# Altium schematic sheet PhaseCLeg.SchDoc: Phase C
size A4; DrawnBy: Jarod Krane; Organization: Altium Limited; Address1: L3, 12a Rodborough Rd; Address2: Frenchs Forest; Address3: NSW; Address4: Australia 2086; Revision: 0; SheetNumber: 6; SheetTotal: 11
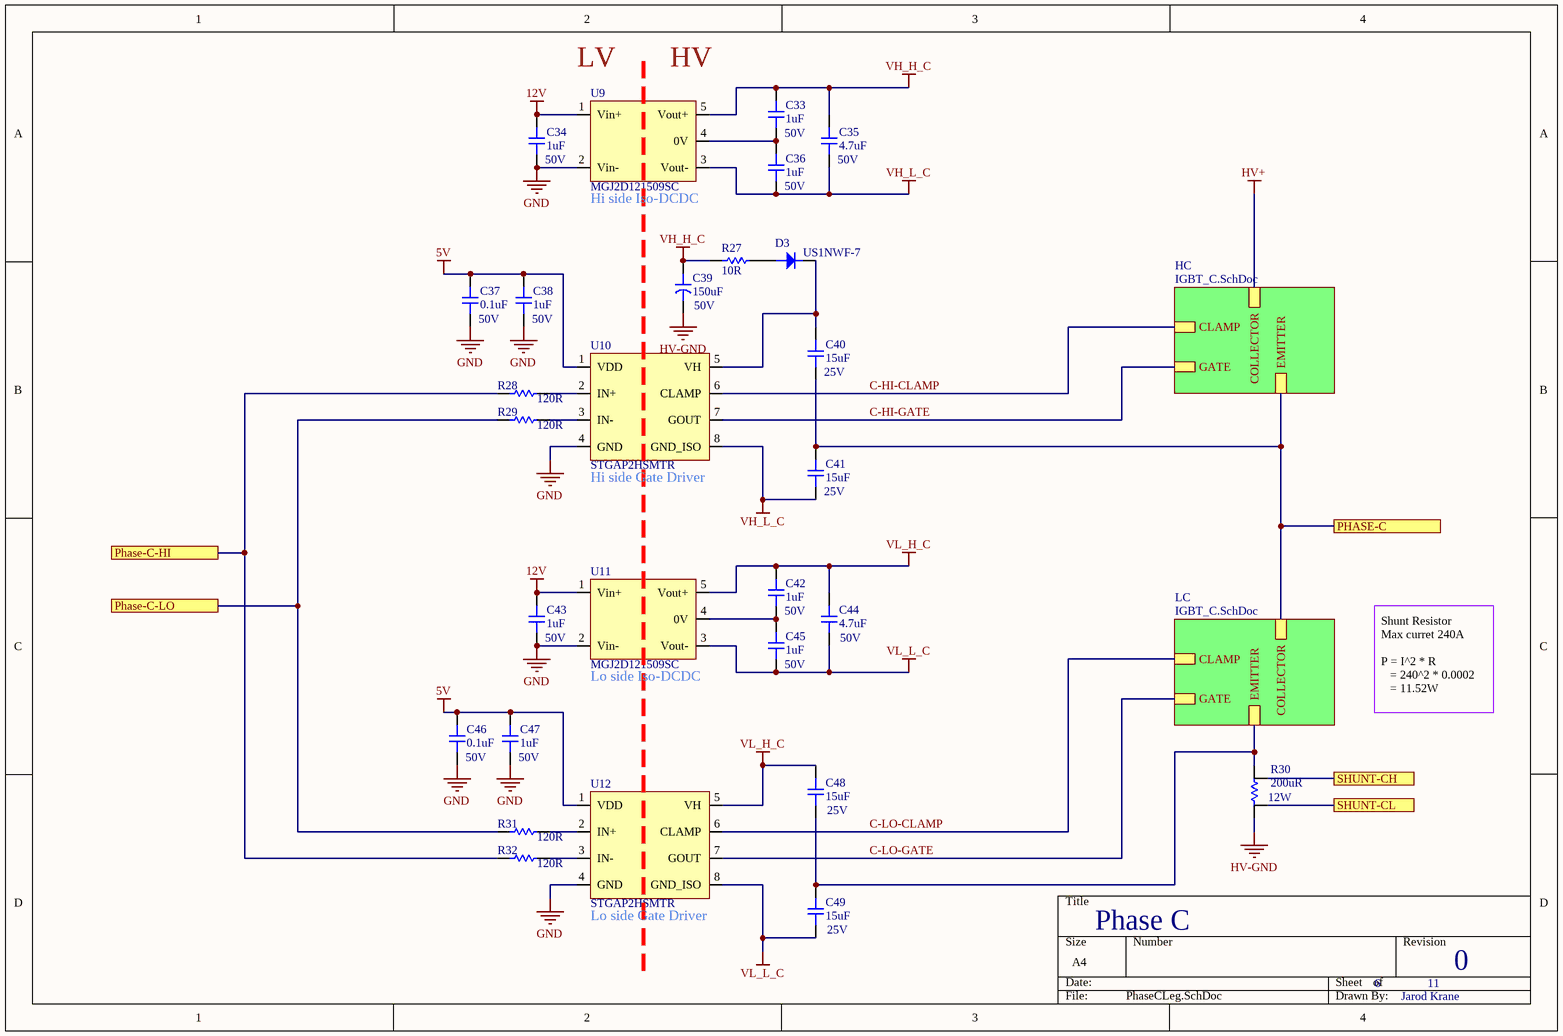
[diagram p0: PhaseCLeg.SchDoc]

## Parts
C33  1uF  Voltage Rating: 50V  [CAP-0805]
C34  1uF  Voltage Rating: 50V  [CAP-0805]
C35  4.7uF  Voltage Rating: 50V  [CAP-1206]
C36  1uF  Voltage Rating: 50V  [CAP-0805]
C37  0.1uF  Voltage: 50V  [CAP-0805]
C38  1uF  Voltage Rating: 50V  [CAP-0805]
C39  150uF  Voltage: 50V  [CAPCAN-10mm]
C40  15uF  Voltage: 25V  [CAP-1812]
C41  15uF  Voltage: 25V  [CAP-1812]
C42  1uF  Voltage Rating: 50V  [CAP-0805]
C43  1uF  Voltage Rating: 50V  [CAP-0805]
C44  4.7uF  Voltage Rating: 50V  [CAP-1206]
C45  1uF  Voltage Rating: 50V  [CAP-0805]
C46  0.1uF  Voltage: 50V  [CAP-0805]
C47  1uF  Voltage Rating: 50V  [CAP-0805]
C48  15uF  Voltage: 25V  [CAP-1812]
C49  15uF  Voltage: 25V  [CAP-1812]
D3  US1NWF-7  [DIOM2718X12N]
R27  10R  [RES-0603]
R28  120R  [RES-0603]
R29  120R  [RES-0603]
R30  200uR  Power: 12W  [RES-SHUNT]
R31  120R  [RES-0603]
R32  120R  [RES-0603]
U9  MGJ2D121509SC  [MGJ2]
U10  STGAP2HSMTR  [SO-8W]
U11  MGJ2D121509SC  [MGJ2]
U12  STGAP2HSMTR  [SO-8W]

## Sub-sheets
HC = IGBT_C.SchDoc: COLLECTOR, EMITTER, GATE, CLAMP
LC = IGBT_C.SchDoc: COLLECTOR, EMITTER, GATE, CLAMP

## Ports
PHASE-C, Phase-C-HI, Phase-C-LO, SHUNT-CH, SHUNT-CL

## Nets
5V: C37.2 C38.2 C46.2 C47.2 U10.1(VDD) U12.1(VDD)
12V: C34.2 C43.2 U9.1(Vin+) U11.1(Vin+)
GND: C34.1 C37.1 C38.1 C43.1 C46.1 C47.1 U9.2(Vin-) U10.4(GND) U11.2(Vin-) U12.4(GND)
HV+: sheet HC/COLLECTOR
HV-GND: C39.2 R30.1
VH_H_C: C33.2 C35.2 C39.1 R27.1 U9.5(Vout+)
VH_L_C: C35.1 C36.1 C41.1 U9.3(Vout-) U10.8(GND_ISO)
VL_H_C: C42.2 C44.2 C48.2 U11.5(Vout+) U12.5(VH)
VL_L_C: C44.1 C45.1 C49.1 U11.3(Vout-) U12.8(GND_ISO)
C-HI-CLAMP: U10.6(CLAMP) ; sheet HC/CLAMP
C-HI-GATE: U10.7(GOUT) ; sheet HC/GATE
C-LO-CLAMP: U12.6(CLAMP) ; sheet LC/CLAMP
C-LO-GATE: U12.7(GOUT) ; sheet LC/GATE
PHASE-C: C40.1 C41.2 ; port PHASE-C, sheet HC/EMITTER, sheet LC/COLLECTOR
Phase-C-HI: R28.1 R32.1 ; port Phase-C-HI
Phase-C-LO: R29.1 R31.1 ; port Phase-C-LO
SHUNT-CH: R30.4 ; port SHUNT-CH
SHUNT-CL: R30.3 ; port SHUNT-CL
NetC33_1: C33.1 C36.2 U9.4(0V)
NetC40_2: C40.2 D3.1 U10.5(VH)
NetC42_1: C42.1 C45.2 U11.4(0V)
NetC48_1: C48.1 C49.2 R30.2 ; sheet LC/EMITTER
NetD3_2: D3.2 R27.2
NetR28_2: R28.2 U10.2(IN+)
NetR29_2: R29.2 U10.3(IN-)
NetR31_2: R31.2 U12.2(IN+)
NetR32_2: R32.2 U12.3(IN-)

## Notes on the sheet
- (near U9) LV
- (near U9) HV
- (near U9) Hi side Iso-DCDC
- (near U10) Hi side Gate Driver
- (near U11) Lo side Iso-DCDC
- Shunt Resistor
  Max curret 240A
  P = I^2 * R
  = 240^2 * 0.0002
  = 11.52W
- (near U12) Lo side Gate Driver
- Title
- Size:
- Date:
- A4
- Number:
- Time:
- Revision:
- Sheet
- of
- File:

## Library data of the parts
C33 C34 C36 C38 C42 C43 C45 C47 = 0805-1uF-50V: CAP CER 1UF 50V X5R 0805; Manufacturer: KEMET; Manufacturer Part Number: C0805C105K5PACTU; Dielectric Material: Ceramic; Tolerance: 10%; Supplier 1: Digi-Key; Stock 1: 7193; Pricing 1: 1=0.33, 10=0.23, 100=0.1378, 500=0.10334, 1000=0.08726 (USD); Mount: Surface Mount; Case/Package: 0805; Weight: 0.000194oz; Case Code (Metric): 2012; Case Code (Imperial): 0805; Min Operating Temperature: -55°C; Max Operating Temperature: 85°C; Dielectric: X5R; Packaging: Tape and Reel; Termination: SMD/SMT; Voltage Rating (DC): 50V; Package Quantity: 2500; Capacitance: 1uF; Length: 0.079inch; Width: 0.049inch; Thickness: 0.055inch; REACH SVHC: No SVHC; Lead Free: Lead Free; ComponentLink1URL: https://api.kemet.com/component-edge/download/datasheet/C0805C105K5PAC7800.pdf?src-supplier=Digi-Key; ComponentLink1Description: https://api.kemet.com/component-edge/download/datasheet/C0805C105K5PAC7800.pdf?src-supplier=Digi-Key; ComponentLink2URL: http://www.farnell.com/datasheets/2746140.pdf?src-supplier=Farnell; ComponentLink2Description: http://www.farnell.com/datasheets/2746140.pdf?src-supplier=Farnell; ComponentLink3URL: http://www.mouser.com/ds/2/212/KEM_C1006_X5R_SMD-1103249.pdf?src-supplier=Mouser; ComponentLink3Description: http://www.mouser.com/ds/2/212/KEM_C1006_X5R_SMD-1103249.pdf?src-supplier=Mouser; ComponentLink4URL: http://www.farnell.com/datasheets/2746140.pdf?src-supplier=Newark; ComponentLink4Description: http://www.farnell.com/datasheets/2746140.pdf?src-supplier=Newark; ComponentLink5URL: http://www.farnell.com/datasheets/2032728.pdf?src-supplier=Element14; ComponentLink5Description: http://www.farnell.com/datasheets/2032728.pdf?src-supplier=Element14; Supplier Part Number 1: 399-15436-6-ND
C35 C44 = 1206-4.7uF-50V: CAP CER 4.7UF 50V X7R 1206; Manufacturer: TDK; Manufacturer Part Number: C3216X7R1H475K160AC; Dielectric Material: Ceramic; Tolerance: 10%; Supplier 1: Digi-Key; Stock 1: 117540; Pricing 1: 1=0.76, 10=0.535, 50=0.4042, 100=0.3521, 500=0.26082, 1000=0.2217 (USD); Mount: Surface Mount; Case/Package: 1206; Case Code (Metric): 3216; Case Code (Imperial): 1206; Weight: 0.000571oz; Min Operating Temperature: -55°C; Max Operating Temperature: 125°C; Capacitance: 4.7uF; Packaging: Tape and Reel; Voltage Rating (DC): 50V; Termination: SMD/SMT; Series: C; Package Quantity: 1; Dielectric: X7R; Resistor Type: Ceramic; Length: 3.2mm; Width: 0.063inch; Depth: 1.6mm; Thickness: 1.6mm; REACH SVHC: No SVHC; Lead Free: Lead Free; RoHS Compliant: Yes; ComponentLink1URL: https://product.tdk.com/info/en/catalog/datasheets/mlcc_commercial_general_en.pdf?src-supplier=Digi-Key; ComponentLink1Description: https://product.tdk.com/info/en/catalog/datasheets/mlcc_commercial_general_en.pdf?src-supplier=Digi-Key; ComponentLink2URL: http://www.mouser.com/ds/2/400/lcc_commercial_general_en-560200.pdf?src-supplier=Mouser; ComponentLink2Description: http://www.mouser.com/ds/2/400/lcc_commercial_general_en-560200.pdf?src-supplier=Mouser; ComponentLink3URL: http://product.tdk.com/capacitor/mlcc/en/documents/mlcc_commercial_general_en.pdf?src-supplier=Future+Electronics; ComponentLink3Description: http://product.tdk.com/capacitor/mlcc/en/documents/mlcc_commercial_general_en.pdf?src-supplier=Future+Electronics; Supplier Part Number 1: 445-8032-6-ND
C37 C46 = 0805-0.1uF-50V: CAP CER 0.1UF 50V Y5V 0805; Manufacturer: KEMET; Manufacturer Part Number: C0805C104Z5VACTU; Dielectric Material: Ceramic; Capacitance: 100nF; Tolerance: 80%; Dissipation Factor: 5%; Supplier 1: Digi-Key; Stock 1: 929243; Pricing 1: 1=0.1, 10=0.057, 100=0.0254, 500=0.01818, 1000=0.01428 (USD); Mount: Surface Mount,PCB; Case/Package: 0805; Number of Pins: 2; Case Code (Metric): 2012; Case Code (Imperial): 0805; Min Operating Temperature: -30°C; Max Operating Temperature: 85°C; Package Quantity: 1; Voltage Rating: 50V; Packaging: Tape and Reel; Voltage Rating (DC): 50V; Dielectric: Y5V; Termination: SMD/SMT; Length: 2mm; Height: 0.9mm; Lead Pitch: 0.75mm; Width: 0.049inch; Thickness: 0.039inch; Depth: 1.25mm; Radiation Hardening: No; REACH SVHC: No SVHC; Lead Free: Lead Free; ComponentLink1URL: http://www.alliedelec.com/m/d/9bfe7773041ffe9d406e68bc7b377fdd.pdf?src-supplier=Allied+Electronics; ComponentLink1Description: http://www.alliedelec.com/m/d/9bfe7773041ffe9d406e68bc7b377fdd.pdf?src-supplier=Allied+Electronics; ComponentLink2URL: https://www.verical.com/server-webapp/html/getDatasheet?partID=37101&src-supplier=Verical; ComponentLink2Description: https://www.verical.com/server-webapp/html/getDatasheet?partID=37101&src-supplier=Verical; ComponentLink3URL: https://www.verical.com/server-webapp/html/getDatasheet?partID=321176&src-supplier=Verical; ComponentLink3Description: https://www.verical.com/server-webapp/html/getDatasheet?partID=321176&src-supplier=Verical; ComponentLink4URL: http://www.farnell.com/datasheets/2123124.pdf?src-supplier=Element14; ComponentLink4Description: http://www.farnell.com/datasheets/2123124.pdf?src-supplier=Element14; Supplier Part Number 1: 399-1177-6-ND
C39 = 10mm-150uF-50V: CAP POLYMER HYBRID 150UF 50V SMD; Manufacturer: Panasonic; Manufacturer Part Number: EEHZS1H151P; Supplier 1: Digi-Key; Stock 1: 1212; Pricing 1: 1=2.07, 10=1.673, 50=1.46, 100=1.2775 (USD); Supplier Part Number 1: 10-EEH-ZS1H151PDKR-ND
C40 C41 C48 C49 = 1812-15uF-25V: CAP CER 15UF 25V X7R 1812; Manufacturer: TDK; Manufacturer Part Number: C4532X7R1E156M280KB; Dielectric Material: Ceramic; Tolerance: 20%; Supplier 1: Digi-Key; Stock 1: 9166; Pricing 1: 1=1.18, 10=0.932, 50=0.8072, 100=0.6986 (USD); Mount: Surface Mount; Case/Package: 1812; Number of Pins: 2; Case Code (Imperial): 1812; Case Code (Metric): 4532; Weight: 0.000952oz; Min Operating Temperature: -55°C; Max Operating Temperature: 125°C; Voltage Rating: 25V; Capacitance: 15uF; Voltage Rating (DC): 25V; Packaging: Tape and Reel; Dielectric: X7R; Termination: SMD/SMT; Package Quantity: 1; Resistor Type: Ceramic; Series: C; Length: 4.5mm; Width: 0.126inch; Height: 2.8mm; Depth: 3.2mm; Thickness: 0.122inch; RoHS Compliant: Yes; Lead Free: Lead Free; REACH SVHC: No SVHC; ComponentLink1URL: http://www.farnell.com/datasheets/1913358.pdf?src-supplier=Element14; ComponentLink1Description: http://www.farnell.com/datasheets/1913358.pdf?src-supplier=Element14; ComponentLink2URL: https://product.tdk.com/info/en/documents/chara_sheet/C4532X7R1E156M280KB.pdf?src-supplier=Digi-Key; ComponentLink2Description: https://product.tdk.com/info/en/documents/chara_sheet/C4532X7R1E156M280KB.pdf?src-supplier=Digi-Key; ComponentLink3URL: https://product.tdk.com/en/products/common/pdf/mlcc_partnumber_description.pdf?src-supplier=Digi-Key; ComponentLink3Description: https://product.tdk.com/en/products/common/pdf/mlcc_partnumber_description.pdf?src-supplier=Digi-Key; ComponentLink4URL: http://uk.rs-online.com/webdocs/1532/0900766b81532cd0.pdf?src-supplier=RSComponents; ComponentLink4Description: http://uk.rs-online.com/webdocs/1532/0900766b81532cd0.pdf?src-supplier=RSComponents; ComponentLink5URL: http://www.tdk.com/pdf/general_B11.pdf?src-supplier=Future+Electronics; ComponentLink5Description: http://www.tdk.com/pdf/general_B11.pdf?src-supplier=Future+Electronics; Supplier Part Number 1: 445-3921-6-ND
D3 = Diode 1.2KV-1A: DIODE GEN PURP 1.2KV 1A SOD123F; Manufacturer: Diodes; Reverse Recovery Time: 80ns; Supplier 1: Digi-Key; Manufacturer Part Number: US1NWF-7; Stock 1: 33557; Pricing 1: 1=0.54, 10=0.438, 100=0.2985, 500=0.22388, 1000=0.1679 (USD); Mount: Surface Mount; Packaging: Tape and Reel; Max Reverse Voltage (DC): 1.2kV; Average Rectified Current: 1A; ComponentLink1URL: https://www.diodes.com/assets/Datasheets/US1NWF.pdf?src-supplier=Digi-Key; ComponentLink1Description: https://www.diodes.com/assets/Datasheets/US1NWF.pdf?src-supplier=Digi-Key; Supplier Part Number 1: US1NWF-7DIDKR-ND
R27 = 0603-10R: RES SMD 10 OHM 1% 1/10W 0603; Manufacturer: Yageo; Manufacturer Part Number: RC0603FR-0710RL; Voltage Rating (DC): 50V; Temperature Coefficient: 200ppm/°C; Power Rating: 100mW; Supplier 1: Digi-Key; Stock 1: 11151092; Pricing 1: 1=0.1, 10=0.046, 100=0.0187, 1000=0.0084, 2500=0.00729 (USD); Case/Package: 0603; Number of Pins: 2; Case Code (Imperial): 0603; Case Code (Metric): 1608; Contact Plating: Tin,Matte; Min Operating Temperature: -55°C; Max Operating Temperature: 155°C; Packaging: Tape and Reel; Resistance: 10R; Tolerance: 1%; Composition: Thick Film; Voltage Rating: 50V; Termination: SMD/SMT; Military Standard: Not; Length: 1.6mm; Height: 0.45mm; Width: 0.8mm; Depth: 0.8mm; Radiation Hardening: No; REACH SVHC: No SVHC; Lead Free: Lead Free; ComponentLink1URL: http://www.farnell.com/datasheets/1868787.pdf?src-supplier=Element14; ComponentLink1Description: http://www.farnell.com/datasheets/1868787.pdf?src-supplier=Element14; ComponentLink2URL: http://www.yageo.com/documents/recent/PYu-RC0603_51_RoHS_L_4.pdf?src-supplier=Avnet; ComponentLink2Description: http://www.yageo.com/documents/recent/PYu-RC0603_51_RoHS_L_4.pdf?src-supplier=Avnet; ComponentLink3URL: http://documents.rs-components.com/techlib://itc_doclist_GB.htm?stockno=5048984&src-supplier=RSComponents; ComponentLink3Description: http://documents.rs-components.com/techlib://itc_doclist_GB.htm?stockno=5048984&src-supplier=RSComponents; ComponentLink4URL: http://www.yageo.com/documents/recent/PYu-RC0603_51_RoHS_L_4.pdf?src-supplier=Avnet+Europe; ComponentLink4Description: http://www.yageo.com/documents/recent/PYu-RC0603_51_RoHS_L_4.pdf?src-supplier=Avnet+Europe; Supplier Part Number 1: 311-10.0HRDKR-ND
R28 R29 R31 R32 = 0603-120R: RES SMD 120 OHM 1% 1/10W 0603; Manufacturer: Yageo; Manufacturer Part Number: RC0603FR-07120RL; Voltage Rating (DC): 50V; Temperature Coefficient: 100ppm/°C; Power Rating: 100mW; Supplier 1: Digi-Key; Stock 1: 1047274; Pricing 1: 1=0.1, 10=0.023, 100=0.0094, 1000=0.00421, 2500=0.00366 (USD); Case/Package: 0603; Number of Pins: 2; Case Code (Metric): 1608; Case Code (Imperial): 0603; Min Operating Temperature: -55°C; Max Operating Temperature: 155°C; Resistance: 120R; Tolerance: 1%; Packaging: Tape and Reel; Composition: Thick Film; Voltage Rating: 50V; Package Quantity: 1; Number of Terminations: 2; Termination: SMD/SMT; Military Standard: Not; Max Power Dissipation: 100mW; Features: Moisture Resistant; Length: 1.6mm; Height: 0.022inch; Width: 0.031inch; Depth: 0.8mm; REACH SVHC: No SVHC; Lead Free: Lead Free; ComponentLink1URL: http://www.yageo.com/documents/recent/PYu-RC_Group_51_RoHS_L_10.pdf?src-supplier=Digi-Key; ComponentLink1Description: http://www.yageo.com/documents/recent/PYu-RC_Group_51_RoHS_L_10.pdf?src-supplier=Digi-Key; ComponentLink2URL: http://www.farnell.com/datasheets/2167052.pdf?src-supplier=Element14; ComponentLink2Description: http://www.farnell.com/datasheets/2167052.pdf?src-supplier=Element14; ComponentLink3URL: http://www.farnell.com/datasheets/1868787.pdf?src-supplier=Element14; ComponentLink3Description: http://www.farnell.com/datasheets/1868787.pdf?src-supplier=Element14; ComponentLink4URL: http://www.farnell.com/datasheets/443971.pdf?src-supplier=Element14; ComponentLink4Description: http://www.farnell.com/datasheets/443971.pdf?src-supplier=Element14; Supplier Part Number 1: 311-120HRDKR-ND
R30 = 3920-200uR-SHUNT: RES SMD 200 UOHM 1% 12W 3920; Manufacturer: Bourns; Manufacturer Part Number: CSS2H-3920R-L200FE; Supplier 1: Digi-Key; Stock 1: 420; Pricing 1: 1=1.6, 10=1.42, 25=1.3052, 50=1.1908, 100=1.0305, 250=0.8702, 500=0.7328 (USD); RoHS Compliant: Yes; ComponentLink1URL: https://www.bourns.com/docs/Product-Datasheets/css2h-3920.pdf?src-supplier=Digi-Key; ComponentLink1Description: https://www.bourns.com/docs/Product-Datasheets/css2h-3920.pdf?src-supplier=Digi-Key; Supplier Part Number 1: CSS2H-3920R-L200FEDKR-ND
U9 U11 = 15V/-8.7V: Isolated Module DC DC Converter Output 15V -8.7V - 80mA, 40mA 10.8V - 13.2V Input; Manufacturer: Murata; Number of Outputs: 2; Output Power: 2W; Isolation Voltage: 5.2kV; Efficiency: 80%; Nominal Input Voltage: 12V; Supplier 1: Digi-Key; Manufacturer Part Number: MGJ2D121509SC; Stock 1: 371; Pricing 1: 1=8.46, 5=8.42, 10=8.36, 25=8.27, 50=8.06, 100=7.66, 250=7.17, 500=6.68, 1000=6.65 (USD); Mount: Through Hole; Case/Package: SIP; Number of Pins: 5; Weight: 0.151678oz; Min Operating Temperature: -40°C; Max Operating Temperature: 100°C; Max Input Voltage: 13.2V; Min Input Voltage: 10.8V; Packaging: Rail/Tube; Max Input Voltage (DC): 13.2V; Min Input Voltage (DC): 10.8V; Voltage - Output 1: 15V; Voltage - Output 2: -8.7V; Max Output Current: 40mA; Current - Output 1: 80mA; Current - Output 2: 40mA; Max Output Power: 2W; Output Voltage: 15V; Output Current: 80mA; Max Power Dissipation: 2W; Package Quantity: 25; Features: SCP; Length: 0.77inch; Width: 0.39inch; Height: 0.5inch; Depth: 12.65mm; Radiation Hardening: No; REACH SVHC: No SVHC; RoHS Compliant: Yes; ComponentLink1URL: http://www.farnell.com/datasheets/1965123.pdf?src-supplier=Element14; ComponentLink1Description: http://www.farnell.com/datasheets/1965123.pdf?src-supplier=Element14; ComponentLink2URL: http://power.murata.com/data/power/ncl/kdc_mgj2.pdf?src-supplier=Avnet; ComponentLink2Description: http://power.murata.com/data/power/ncl/kdc_mgj2.pdf?src-supplier=Avnet; Supplier Part Number 1: 811-3002-5-ND
U10 U12 = STGAP2HSMTR: GALVANICALLY ISOLATED 4 A SINGLE GATE DRIVER; Manufacturer: Samtec; Manufacturer Part Number: ERF8-010-07.0-L-DV-L-K-TR; Supplier 1: Digi-Key; Stock 1: 498; Pricing 1: 1=3.01, 10=2.699, 25=2.5516, 100=2.2113, 250=2.09788, 500=1.88242 (USD); Supplier Part Number 1: 497-STGAP2HSMDKR-ND